# Altium schematic sheet FLUOLAMP_8W_DRIVER.SchDoc
size A4; SheetNumber: 1; SheetTotal: 1
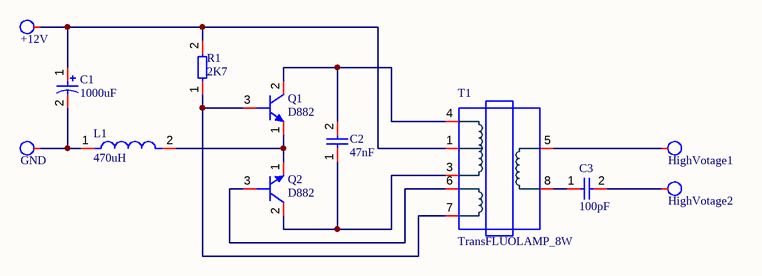
[diagram p0: FLUOLAMP_8W_DRIVER.SchDoc]

## Parts
+12V  SolderPoint  [SolderPoint]  (value not drawn)
C1  1000uF  [CAP_RAD_7mm]
C2  47nF  [CAP_DISC_4x3_YL-LM]
C3  100pF  [CAP_DISC_9x3_BL]
GND  SolderPoint  [SolderPoint]  (value not drawn)
HighVotage1  SolderPoint  [SolderPoint]  (value not drawn)
HighVotage2  SolderPoint  [SolderPoint]  (value not drawn)
L1  470uH  [INDUCTOR_470uH]
Q1  D882  [TO-126]
Q2  D882  [TO-126]
R1  2K7  [RES-0.25W-H-MF]
T1  TransFLUOLAMP_8W  [TRANS_FLUOLAMP_8W]

## Nets
Net+12V_1: +12V.1 C1.1 R1.2 T1.1
NetC1_2: C1.2 GND.1 L1.1
NetC2_1: C2.1 Q2.2(C) T1.3
NetC2_2: C2.2 Q1.2(C) T1.4
NetC3_1: C3.1 T1.8
NetC3_2: C3.2 HighVotage2.1
NetHighVotage1_1: HighVotage1.1 T1.5
NetL1_2: L1.2 Q1.1(E) Q2.1(E)
NetQ1_3: Q1.3(B) R1.1 T1.7
NetQ2_3: Q2.3(B) T1.6

## Library data of the parts
C1 = Capacitor(Radian)
C2 C3 = Capacitors(Disc)
L1 = Inductor
Q1 Q2 = D882 (TO-126)
R1 = Resistors THD